# EAGLE design HW2 (EAGLE 8.4.1)
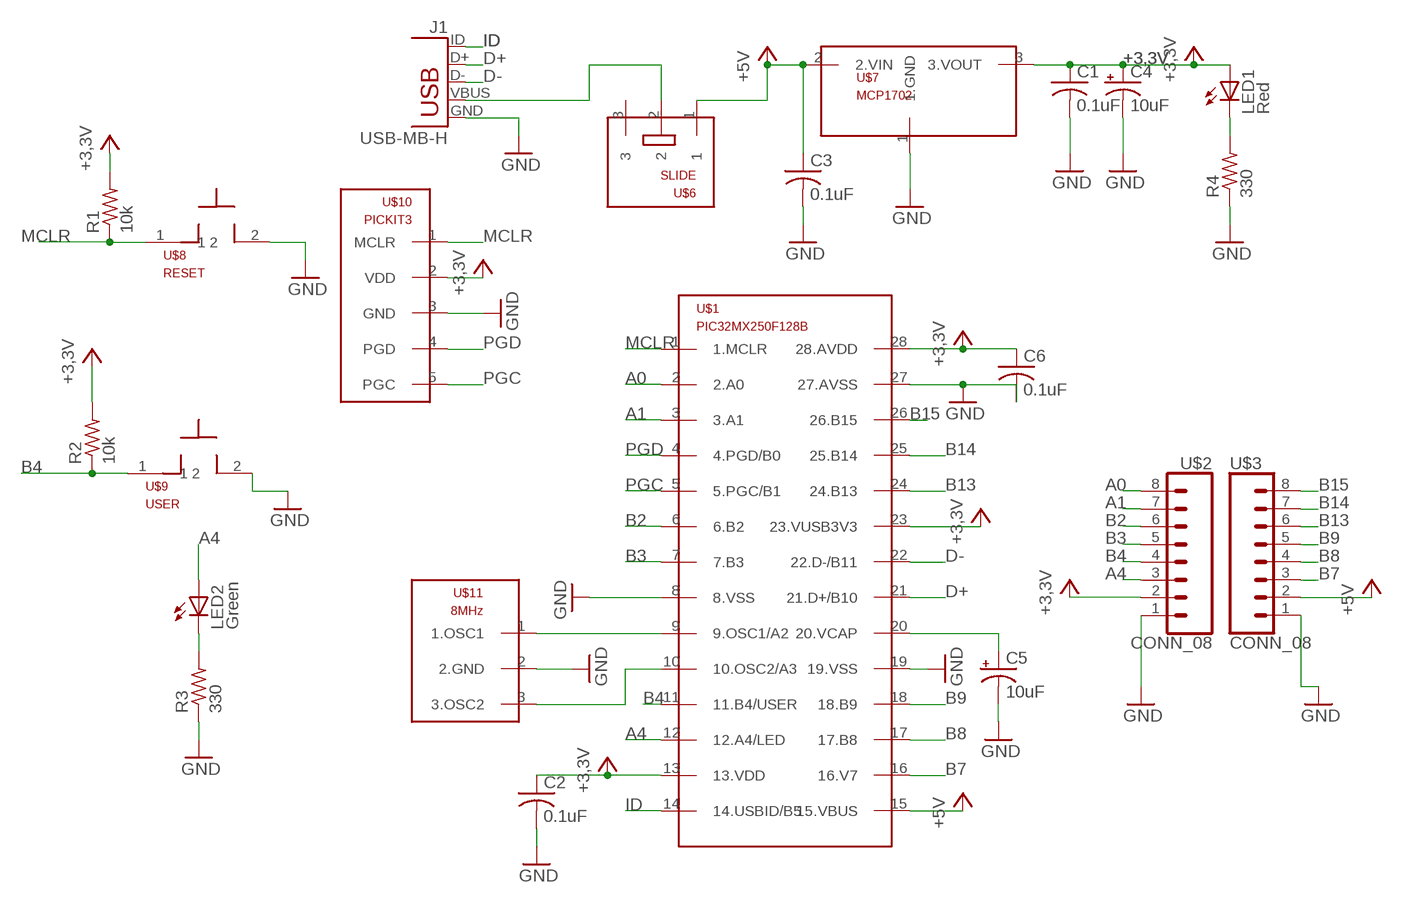
[diagram p0: schematic, sheet 1]

## Parts
C1  0.1uF  C-US025-025X050  [C025-025X050]
C2  0.1uF  C-US025-025X050  [C025-025X050]
C3  0.1uF  C-US025-025X050  [C025-025X050]
C4  10uF  CPOL-USB45181B  [B45181B]
C5  10uF  CPOL-USB45181B  [B45181B]
C6  0.1uF  C-US025-025X050  [C025-025X050]
J1  USB-MB-H  [USB-MB-H]
LED1  Red  LED3MM  [LED3MM]
LED2  Green  LED3MM  [LED3MM]
R1  10k  R-US_0207/10  [0207/10]
R2  10k  R-US_0207/10  [0207/10]
R3  330  R-US_0207/10  [0207/10]
R4  330  R-US_0207/10  [0207/10]
U$1  PIC32MX250F128B  [DIL28-3]
U$2  CONN_08  [1X08]
U$3  CONN_08  [1X08]
U$6  SLIDE  [SLIDE]
U$7  MCP1702  [TO92]
U$8  RESET  PB  [PB]
U$9  USER  PB  [PB]
U$10  PICKIT3  [1X05]
U$11  8MHz  OSC  [OSC]

## Nets
+3,3V: C1.1 C2.1 C4.+ C6.1 LED1.A R1.2 R2.2 U$1.13(13.VDD) U$1.23(23.VUSB3V3) U$1.28(28.AVDD) U$2.2 U$7.3(3.VOUT) U$10.2(VDD)
+5V: C3.1 U$1.15(15.VBUS) U$3.2 U$6.1 U$7.2(2.VIN)
A0: U$1.2(2.A0) U$2.8
A1: U$1.3(3.A1) U$2.7
A4: LED2.A U$1.12(12.A4/LED) U$2.3
B2: U$1.6(6.B2) U$2.6
B3: U$1.7(7.B3) U$2.5
B4: R2.1 U$1.11(11.B4/USER) U$2.4 U$9.1
B7: U$1.16(16.V7) U$3.3
B8: U$1.17(17.B8) U$3.4
B9: U$1.18(18.B9) U$3.5
B13: U$1.24(24.B13) U$3.6
B14: U$1.25(25.B14) U$3.7
B15: U$1.26(26.B15) U$3.8
D+: J1.D+ U$1.21(21.D+/B10)
D-: J1.D- U$1.22(22.D-/B11)
GND: C1.2 C2.2 C3.2 C4.- C5.- C6.2 J1.GND R3.1 R4.1 U$1.8(8.VSS) U$1.19(19.VSS) U$1.27(27.AVSS) U$2.1 U$3.1 U$7.1(1.GND) U$8.2 U$9.2 U$10.3(GND) U$11.2(2.GND)
ID: J1.ID U$1.14(14.USBID/B5)
MCLR: R1.1 U$1.1(1.MCLR) U$8.1 U$10.1(MCLR)
N$1: J1.VBUS U$6.2
N$2: LED1.K(C) R4.2
N$3: U$1.9(9.OSC1/A2) U$11.1(1.OSC1)
N$4: U$1.10(10.OSC2/A3) U$11.3(3.OSC2)
N$5: C5.+ U$1.20(20.VCAP)
N$6: LED2.K(C) R3.2
PGC: U$1.5(5.PGC/B1) U$10.5(PGC)
PGD: U$1.4(4.PGD/B0) U$10.4(PGD)
Unconnected: U$6.3

## Library data of the parts
C1-C3 C6 = HW2:C-US: CAPACITOR, American symbol
C4 C5 = HW2:CPOL-US: POLARIZED CAPACITOR, American symbol
J1 = HW2:USB: USB Connectors USB-B-PTH is fully proven SKU : PRT-00139/CONN-08278 USB-miniB is fully proven SKU : PRT-00587 USB-A-PCB is untested. USB-A-H is throughly reviewed, but untested. Spark Fun Electronics SKU : PRT-00437 USB-B-SMT is throughly reviewed, but untested. Needs silkscreen touching up. USB-A-S has not been used/tested USB-MB-H has not been used/tested USB-MICROB has been used. CONN-09505
LED1 LED2 = led:LED: LED OSRAM: - CHIPLED LG R971, LG N971, LY N971, LG Q971, LY Q971, LO R971, LY R971 LH N974, LH R974 LS Q976, LO Q976, LY Q976 LO Q996 - Hyper CHIPLED LW Q18S LB Q993, LB Q99A, LB R99A - SideLED LS A670, LO A670, LY A670, LG A670, LP A670 LB A673, LV A673, LT A673, LW A673 LH A674 LY A675 LS A676, LA A676, LO A676, LY A676, LW A676 LS A679, LY A679, LG A679 - Hyper Micro SIDELED® LS Y876, LA Y876, LO Y876, LY Y876 LT Y87S - SmartLED LW L88C, LW L88S LB L89C, LB L89S, LG L890 LS L89K, LO L89K, LY L89K LS L896, LA L896, LO L896, LY L896 - TOPLED LS T670, LO T670, LY T670, LG T670, LP T670 LSG T670, LSP T670, LSY T670, LOP T670, LYG T670 LG T671, LOG T671, LSG T671 LB T673, LV T673, LT T673, LW T673 LH T674 LS T676, LA T676, LO T676, LY T676, LB T676, LH T676, LSB T676, LW T676 LB T67C, LV T67C, LT T67C, LS T67K, LO T67K, LY T67K, LW E67C LS E67B, LA E67B, LO E67B, LY E67B, LB E67C, LV E67C, LT E67C LW T67C LS T679, LY T679, LG T679 LS T770, LO T770, LY T770, LG T770, LP T770 LB T773, LV T773, LT T773, LW T773 LH T774 LS E675, LA E675, LY E675, LS T675 LS T776, LA T776, LO T776, LY T776, LB T776 LHGB T686 LT T68C, LB T68C - Hyper Mini TOPLED® LB M676 - Mini TOPLED Santana® LG M470 LS M47K, LO M47K, LY M47K Source: http://www.osram.convergy.de LUXEON: - LUMILED® LXK2-PW12-R00, LXK2-PW12-S00, LXK2-PW14-U00, LXK2-PW14-V00 LXK2-PM12-R00, LXK2-PM12-S00, LXK2-PM14-U00 LXK2-PE12-Q00, LXK2-PE12-R00, LXK2-PE12-S00, LXK2-PE14-T00, LXK2-PE14-U00 LXK2-PB12-K00, LXK2-PB12-L00, LXK2-PB12-M00, LXK2-PB14-N00, LXK2-PB14-P00, LXK2-PB14-Q00 LXK2-PR12-L00, LXK2-PR12-M00, LXK2-PR14-Q00, LXK2-PR14-R00 LXK2-PD12-Q00, LXK2-PD12-R00, LXK2-PD12-S00 LXK2-PH12-R00, LXK2-PH12-S00 LXK2-PL12-P00, LXK2-PL12-Q00, LXK2-PL12-R00 Source: www.luxeon.com KINGBRIGHT: KA-3528ASYC Source: www.kingbright.com
R1-R4 = HW2:R-US_: RESISTOR, American symbol
U$1 = HW2:PIC32MX250F128B
U$2 U$3 = HW2:CONN_08
U$6 = HW2:SLIDE
U$7 = HW2:MCP1702
U$8 U$9 = HW2:PB
U$10 = HW2:PICKIT3
U$11 = HW2:OSC

## Board
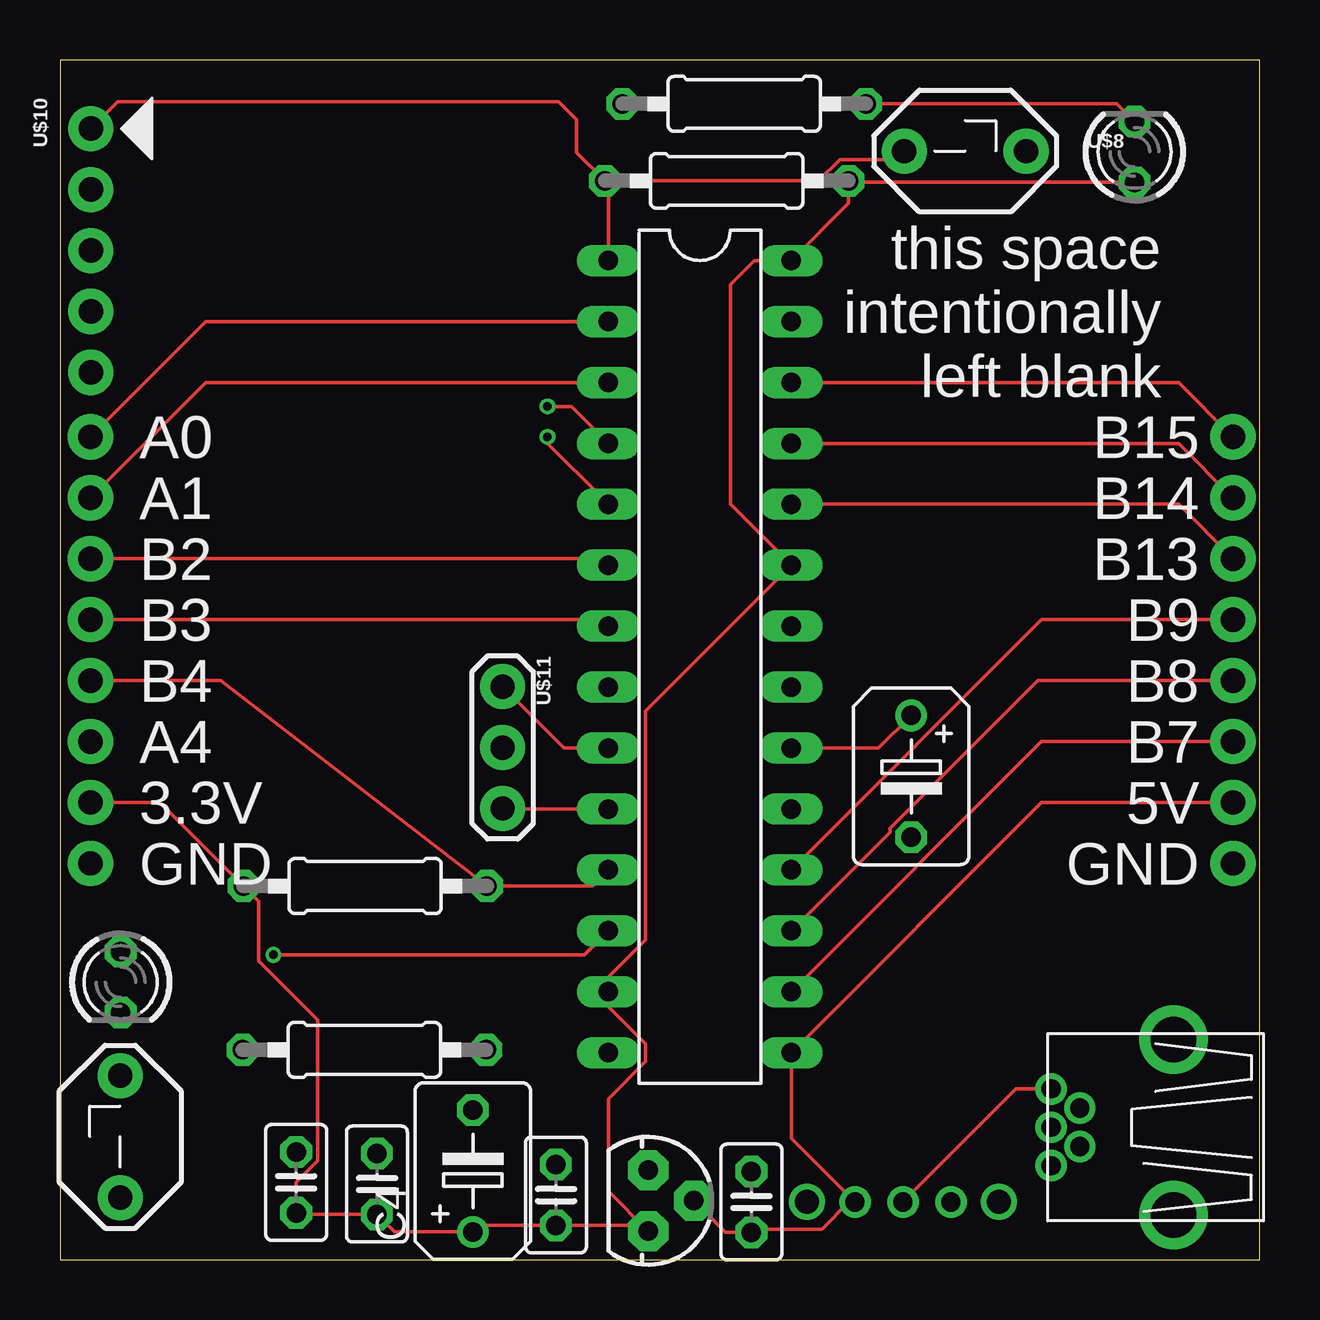
[diagram p1: board, top side]
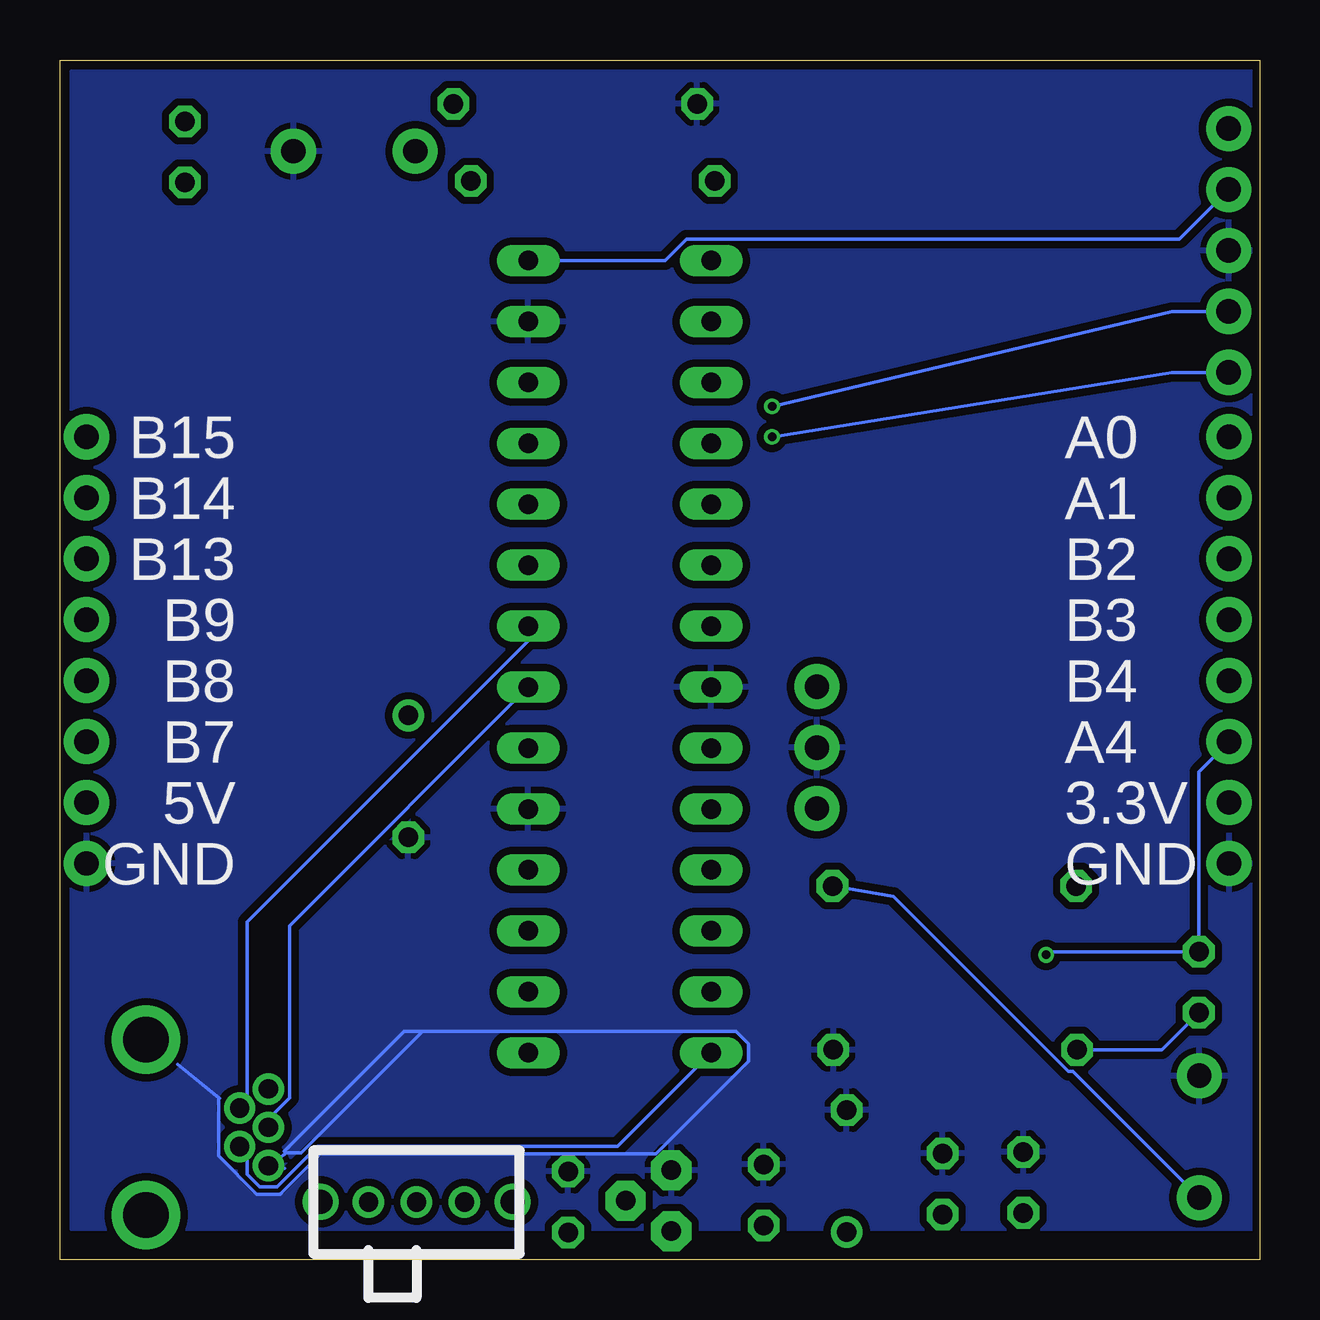
[diagram p2: board, bottom side, seen from below]

Size 50 x 50 mm. Coordinates in mm from the lower left corner, seen from the top.
Outline: 0,0 50,0 50,50 0,50 0,0
Copper layers (1*16): Top 0.035mm / dielectric 1.5mm / Bottom 0.035mm
Design rules "SeeedStudio_2layer_DRU_no_angle_20140221": minimum track width 6mil, minimum drill 12mil, track to track 6mil, track to pad 6mil, pad to pad 6mil, via to via 6mil, smd to smd 0mil, copper to edge 10mil, drill to drill 10mil, minimum pad ring 10mil, minimum via ring 6mil, stop-mask expansion 2mil, vias tented up to drill 100mil, thermal gap 10mil

### Footprints (pad centres in the part's own frame; a part is rotated, then mirrored left to right if it is on the bottom)
C025-025X050 = drill 0.813 octagon: 1 -1.27,0; 2 1.27,0
B45181B = drill 0.813: + -2.54,0 | drill 0.813 octagon: - 2.54,0
USB-MB-H = drill 0.8: D+ 5.1,0; D- 3.9,0.8; GND 5.1,-1.6; ID 3.9,-0.8; VBUS 5.1,1.6 | drill 1.9: P$6 0,-3.65; P$7 0,3.65
LED3MM = drill 0.813 octagon: A -1.27,0; K 1.27,0
0207/10 = drill 0.813 octagon: 1 -5.08,0; 2 5.08,0
DIL28-3 = drill 0.813 long: 1 -16.51,-3.81; 2 -13.97,-3.81; 3 -11.43,-3.81; 4 -8.89,-3.81; 5 -6.35,-3.81; 6 -3.81,-3.81; 7 -1.27,-3.81; 8 1.27,-3.81; 9 3.81,-3.81; 10 6.35,-3.81; 11 8.89,-3.81; 12 11.43,-3.81; 13 13.97,-3.81; 14 16.51,-3.81; 15 16.51,3.81; 16 13.97,3.81; 17 11.43,3.81; 18 8.89,3.81; 19 6.35,3.81; 20 3.81,3.81; 21 1.27,3.81; 22 -1.27,3.81; 23 -3.81,3.81; 24 -6.35,3.81; 25 -8.89,3.81; 26 -11.43,3.81; 27 -13.97,3.81; 28 -16.51,3.81
1X08 = drill 1.016 pad 1.88: 1 0,0; 2 2.54,0; 3 5.08,0; 4 7.62,0; 5 10.16,0; 6 12.7,0; 7 15.24,0; 8 17.78,0
SLIDE = drill 0.8: 1 -2,0; 2 0,0; 3 2,0 | drill 1: P$1 -4,0; P$2 4,0
TO92 = drill 0.813 pad 1.676 octagon: 1 -1.27,0; 2 0,1.905; 3 1.27,0
PB = drill 1.016 pad 1.88: 1 -2.54,0; 2 2.54,0
1X05 = drill 1.016 pad 1.88: 1 0,0; 2 2.54,0; 3 5.08,0; 4 7.62,0; 5 10.16,0
OSC = drill 1.016 pad 1.88: 1 -2.54,0; 2 0,0; 3 2.54,0

### Placement (x,y rotation side)
C1  20.67,2.69 90 top
C2  13.21,3.15 90 top
C3  28.82,2.4 90 top
C4  17.21,3.69 90 top
C5  35.48,20.14 270 top
C6  9.84,3.21 90 top
J1  46.41,5.51 0 bottom
LED1  44.79,46.17 90 top
LED2  2.53,11.56 270 top
R1  27.79,44.96 0 top
R2  12.72,15.57 180 top
R3  12.69,8.74 180 top
R4  28.52,48.17 0 top
U$1  26.67,25.13 270 top
U$2  1.27,16.51 90 top
U$3  48.9,16.51 90 top
U$6  35.14,2.4 180 bottom
U$7  24.52,2.45 270 top
U$8  37.73,46.2 0 top
U$9  2.51,5.12 90 top
U$10  1.28,47.14 270 top
U$11  18.45,21.34 270 top

### Tracks (layer width: path | path; a pad name or v marks a point on that pad's centre or on a via)
+3,3V
  Top 0.152: LED1.A 32.93,44.9 R1.2 32.87,44.03 U$1.28 28.94,41.64 27.94,40.64 27.94,31.48 U$1.23 24.41,22.87 24.41,13.33 22.86,11.78 U$1.13 22.86,10.54 24.41,8.99 24.41,8.25 22.86,6.7 22.86,2.84 U$7.3 24.28,1.42 C1.1 17.48,1.42 C4.+ 13.94,1.15 C2.1 9.91,1.88 C6.1 9.84,3.23 10.73,4.12 10.73,10 8.28,12.45 8.28,14.93 R2.2 4.16,19.05 U$2.2
  Bottom 0.152: U$1.28 24.78,41.64 23.89,42.53 3.35,42.53 U$10.2
+5V
  Top 0.152: U$7.2 27.75,1.13 C3.1 28.96,1.27 31.75,1.27 32.88,2.4 U$6.1 30.48,5.06 U$1.15 40.91,19.05 U$3.2
A0
  Top 0.152: U$2.8 6.08,39.1 U$1.2
A1
  Top 0.152: U$2.7 6.08,36.56 U$1.3
A4  (via drill 0.35)
  Top 0.152: 21.87,12.71 U$1.12 21.86,12.7 v8.89,12.7
  Bottom 0.152: v8.89,12.7 8.76,12.83 LED2.A 2.53,20.33 U$2.3
B2
  Top 0.152: U$1.6 22.59,29.21 U$2.6
B3
  Top 0.152: U$1.7 22.59,26.67 U$2.5
B4
  Top 0.152: U$2.4 6.7,24.13 R2.1 22.19,15.57 U$1.11
  Bottom 0.152: U$9.1 7.78,7.85 7.98,7.85 15.26,15.13 R2.1
B7
  Top 0.152: U$1.16 40.91,21.59 U$3.3
B8
  Top 0.152: U$1.17 34.59,17.81 34.59,17.97 40.75,24.13 U$3.4
B9
  Top 0.152: U$1.18 40.91,26.67 U$3.5
B13
  Top 0.152: U$1.24 46.62,31.48 U$3.6
B14
  Top 0.152: U$1.25 46.62,34.02 U$3.7
B15
  Top 0.152: U$1.26 46.62,36.56 U$3.8
D+
  Bottom 0.152: J1.D+ 41.31,5.86 40.43,6.74 40.43,13.91 U$1.21
D-
  Bottom 0.152: J1.D- 42.19,6.63 42.19,14.06 30.48,25.78 U$1.22
GND
  Bottom 0.152: J1.GND 41.21,3.81 40.64,3.81 | J1.GND 40.92,3.52 J1.GND | 40.45,4.7 40.66,4.51 35.66,9.51 34.89,9.51 | J1.GND 40.55,4.45 39.95,4.45 34.89,9.51 | 21.83,9.51 21.31,8.99 | 21.31,8.99 21.31,8.25 | 43.39,6.68 43.35,6.72 45.1,8.13 43.36,6.71 43.39,6.68 | 39.14,4.41 40.82,2.72 | 40.82,2.72 41.8,2.72 | 34.89,9.51 21.83,9.51 | 21.31,8.25 25.16,4.41 | 25.16,4.41 39.14,4.41 | 41.8,2.72 43.39,4.31 | 43.39,4.31 43.39,6.68 | 21.31,8.25 21.31,8.99 | 21.31,8.99 21.83,9.51 | 41.8,2.72 40.82,2.72 | 40.82,2.72 39.14,4.41 | 43.39,6.68 43.39,4.31 | 43.39,4.31 41.8,2.72 | 39.14,4.41 25.16,4.41 | 25.16,4.41 21.31,8.25 | 21.83,9.51 34.89,9.51
  pour Bottom (isolate 0.305): 0,49.53 49.53,49.53 49.53,1.27 0,1.27
ID
  Bottom 0.152: U$1.14 26.77,4.71 39.26,4.71 40.94,3.03 41.68,3.03 42.19,3.54 42.19,4.39 J1.ID
MCLR
  Top 0.152: R1.1 31.61,44.96 32.5,45.85 34.84,45.85 U$8.1 | R1.1 22.86,44.81 U$1.1 | R1.1 21.53,46.14 21.53,47.5 20.77,48.26 2.4,48.26 U$10.1
N$1
  Top 0.152: J1.VBUS 39.85,7.11 U$6.2
N$2
  Top 0.152: R4.2 44.06,48.17 LED1.K
N$3
  Top 0.152: U$1.9 21.01,21.32 U$11.1
N$4
  Top 0.152: U$1.10 18.47,18.78 U$11.3
N$5
  Top 0.152: C5.+ 34.12,21.32 U$1.20
N$6
  Bottom 0.152: LED2.K 4.08,8.74 R3.2
PGC  (via drill 0.35)
  Top 0.152: U$1.5 20.05,34.29 v20.32,34.29
  Bottom 0.152: v20.32,34.29 3.66,36.98 U$10.5
PGD  (via drill 0.35)
  Top 0.152: U$1.4 21.32,35.56 v20.32,35.56
  Bottom 0.152: v20.32,35.56 3.66,39.52 U$10.4

### Text on the board
tNames: this space / intentionally / left blank | B15 | A0 | B14 | A1 | B13 | B2 | B9 | B3 | B8 | B4 | B7 | A4 | 5V | 3.3V | GND | GND
bNames: B15 | A0 | B14 | A1 | B13 | B2 | B9 | B3 | B8 | B4 | B7 | A4 | 5V | 3.3V | GND | GND